# EAGLE design PCB (EAGLE 9.6.2)
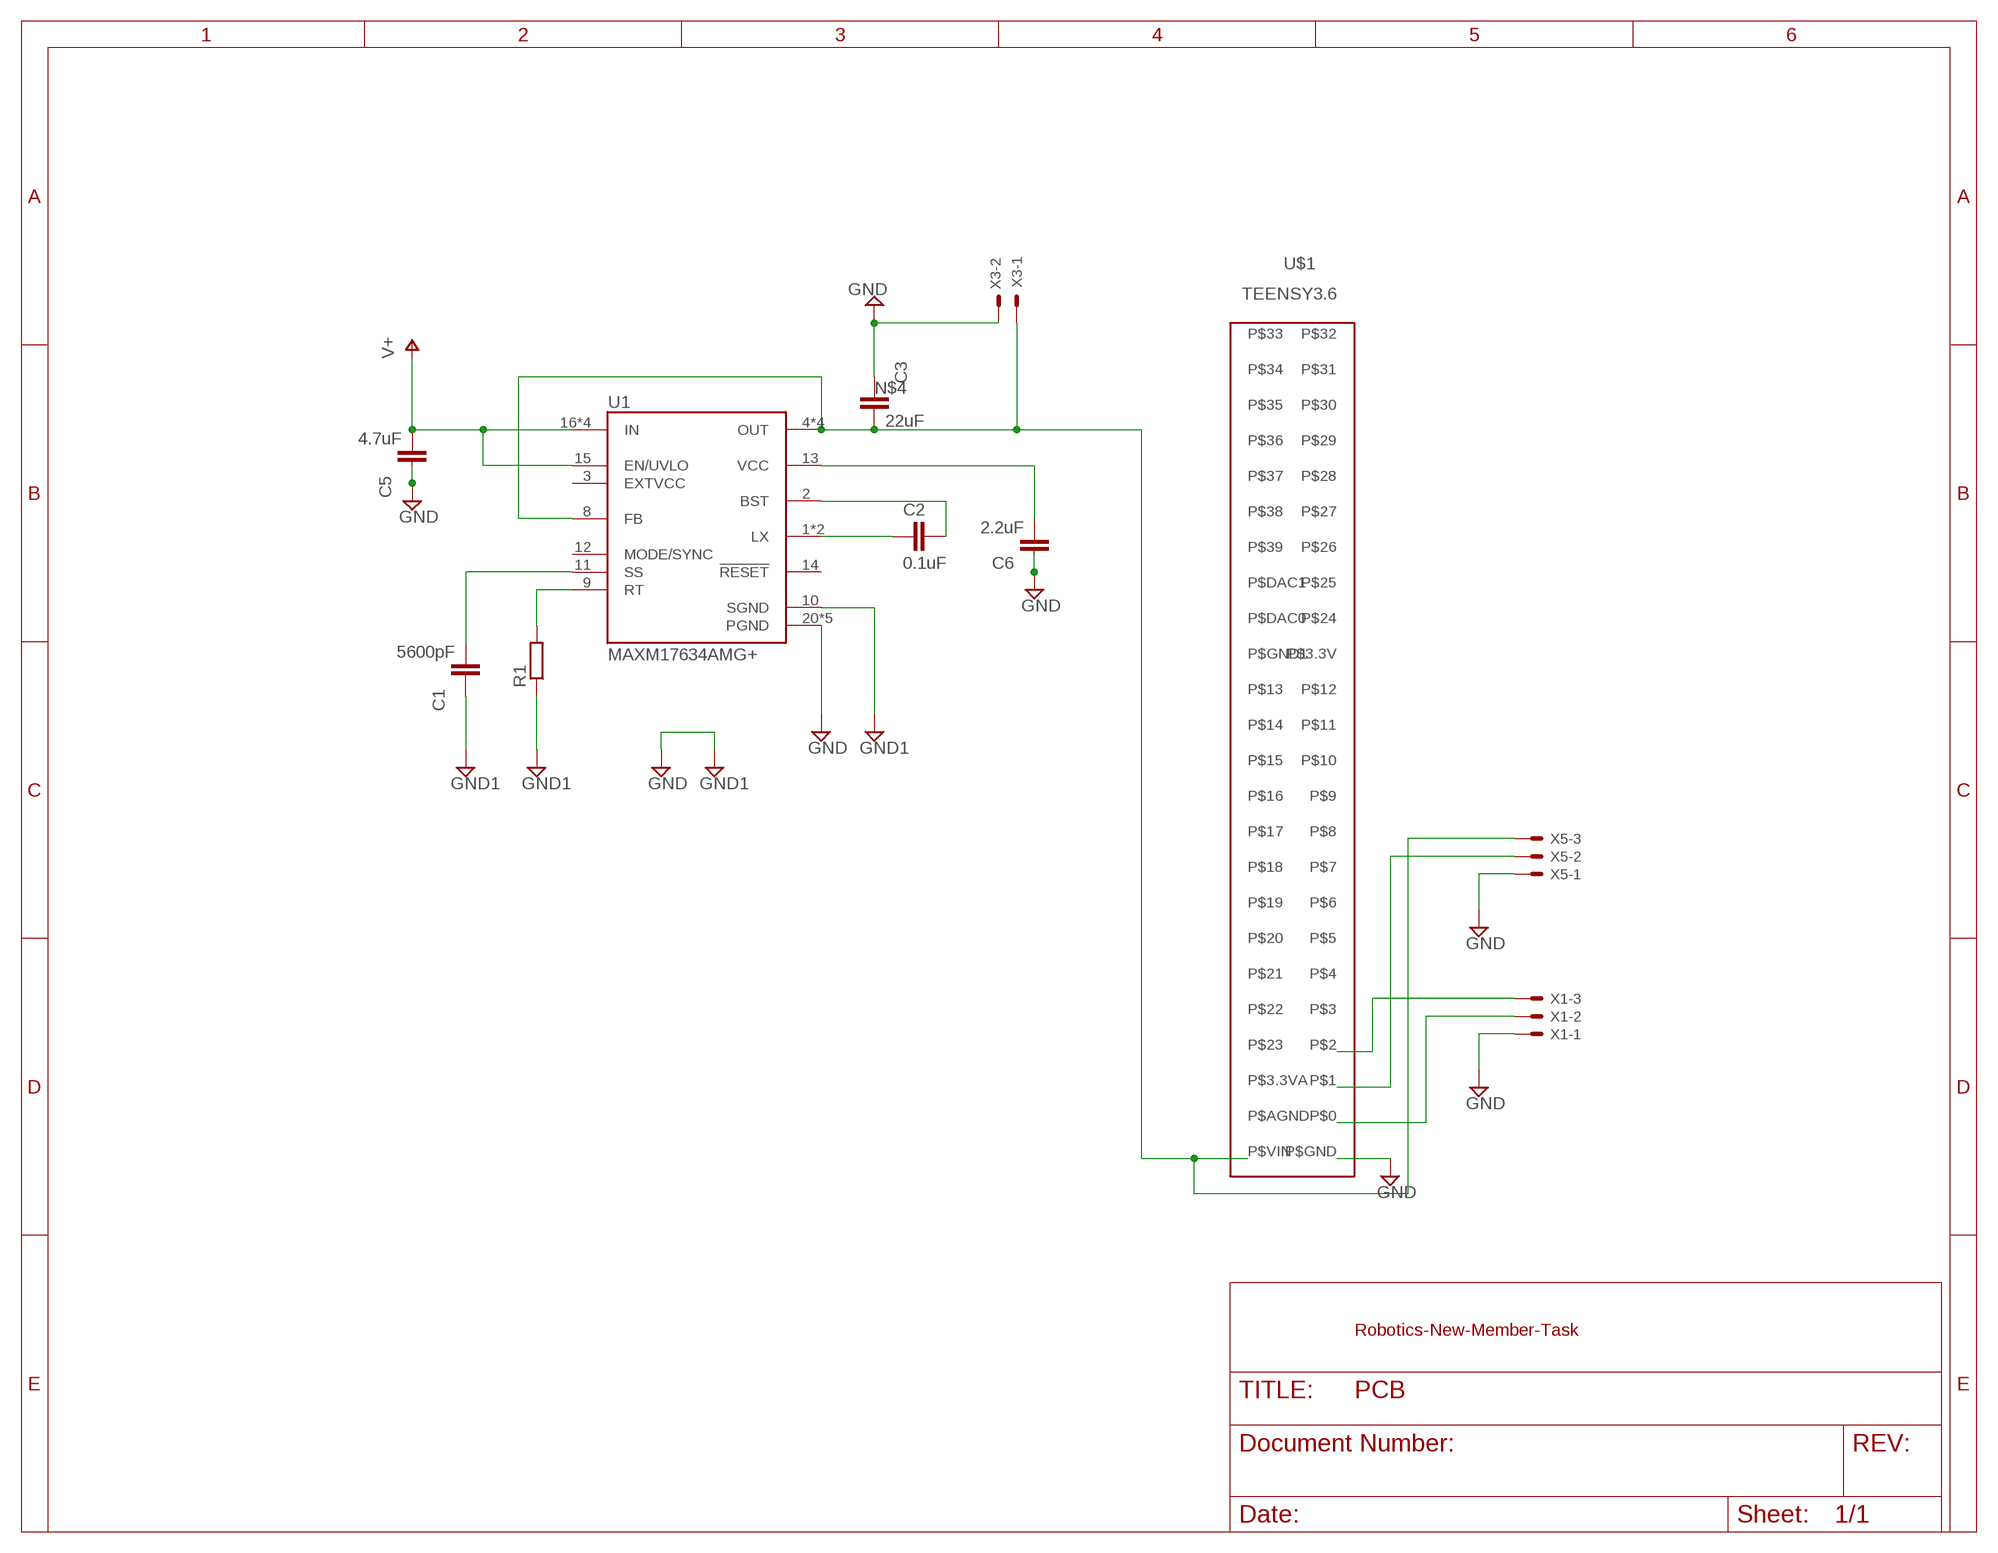
[diagram p0: schematic, sheet 1]

## Parts
C1  5600pF  C-EUC0805  [C0805]
C2  0.1uF  C-EUC0805  [C0805]
C3  22uF  C-EUC0805  [C0805]
C5  4.7uF  C-EUC0805  [C0805]
C6  2.2uF  C-EUC0805  [C0805]
R1  R-EU_R0805  [R0805]
U1  MAXM17634AMG+  [QFN50P400X400X180-25N]
U$1  TEENSY3.6  [TEENSY3.6]
X1  KK-156-3  [KK-156-3]
X3  KK-156-2  [KK-156-2]
X5  KK-156-3  [KK-156-3]

## Nets
GND: C3.1 C5.1 C6.1 U1.20(PGND) U1.21(PGND) U1.22(PGND) U1.23(PGND) U1.25(PGND) U$1.P$GND X1.1 X3.2 X5.1 ; supply symbol labelled GND1
GND1: C1.1 R1.1 U1.10(SGND)
N$1: C6.2 U1.13(VCC)
N$2: R1.2 U1.9(RT)
N$3: C1.2 U1.11(SS)
N$4: C3.2 U1.4(OUT) U1.5(OUT) U1.6(OUT) U1.7(OUT) U1.8(FB) U$1.P$VIN X3.1 X5.3
N$5: C2.1 U1.2(BST)
N$6: C2.2 U1.1(LX) U1.24(LX)
N$7: U$1.P$0 X1.2
N$8: U$1.P$1 X5.2
N$9: U$1.P$2 X1.3
V+: C5.2 U1.15(EN/UVLO) U1.16(IN) U1.17(IN) U1.18(IN) U1.19(IN)
Unconnected: U1.3(EXTVCC) U1.12(MODE/SYNC) U1.14(!RESET!) U$1.P$3 U$1.P$3.3V U$1.P$3.3VA U$1.P$4 U$1.P$5 U$1.P$6 U$1.P$7 U$1.P$8 U$1.P$9 U$1.P$10 U$1.P$11 U$1.P$12 U$1.P$13 U$1.P$14 U$1.P$15 U$1.P$16 U$1.P$17 U$1.P$18 U$1.P$19 U$1.P$20 U$1.P$21 U$1.P$22 U$1.P$23 U$1.P$24 U$1.P$25 U$1.P$26 U$1.P$27 U$1.P$28 U$1.P$29 U$1.P$30 U$1.P$31 U$1.P$32 U$1.P$33 U$1.P$34 U$1.P$35 U$1.P$36 U$1.P$37 U$1.P$38 U$1.P$39 U$1.P$AGND U$1.P$DAC0(P$DAC1) U$1.P$DAC1(P$DAC2) U$1.P$GND1

## Notes on the sheet
- Robotics-New-Member-Task

## Library data of the parts
C1-C3 C5 C6 = rcl:C-EU: CAPACITOR, European symbol; SPICEPREFIX: C
R1 = rcl:R-EU_: RESISTOR, European symbol; SPICEPREFIX: R
U1 = MAXM17634AMG_:MAXM17634AMG+: High-Efficiency Synchronous Buck Regulator Offers Balance of High Performance, Wide Temperature Range, and Small Size; DESCRIPTION: Buck Switching Regulator IC Positive Fixed 5V 1 Output 2A 24-SMD Module Exposed Pad; DIGI-KEY_PART_NUMBER: 175-MAXM17634AMG+TTR-ND; MF: Maxim Integrated; MP: MAXM17634AMG+; PACKAGE: SMD-24 Maxim Integrated; PURCHASE-URL: https://pricing.snapeda.com/search/part/MAXM17634AMG+/?ref=eda
U$1 = TEENSY:TEENSY3.6
X1 X5 = con-molex:KK-156-3: KK 156 HEADER Source: http://www.molex.com/pdm_docs/sd/026604100_sd.pdf; MF: MOLEX; OC_FARNELL: unknown; OC_NEWARK: unknown
X3 = con-molex:KK-156-2: KK 156 HEADER Source: http://www.molex.com/pdm_docs/sd/026604100_sd.pdf; MF: MOLEX; OC_FARNELL: unknown; OC_NEWARK: unknown

## Board
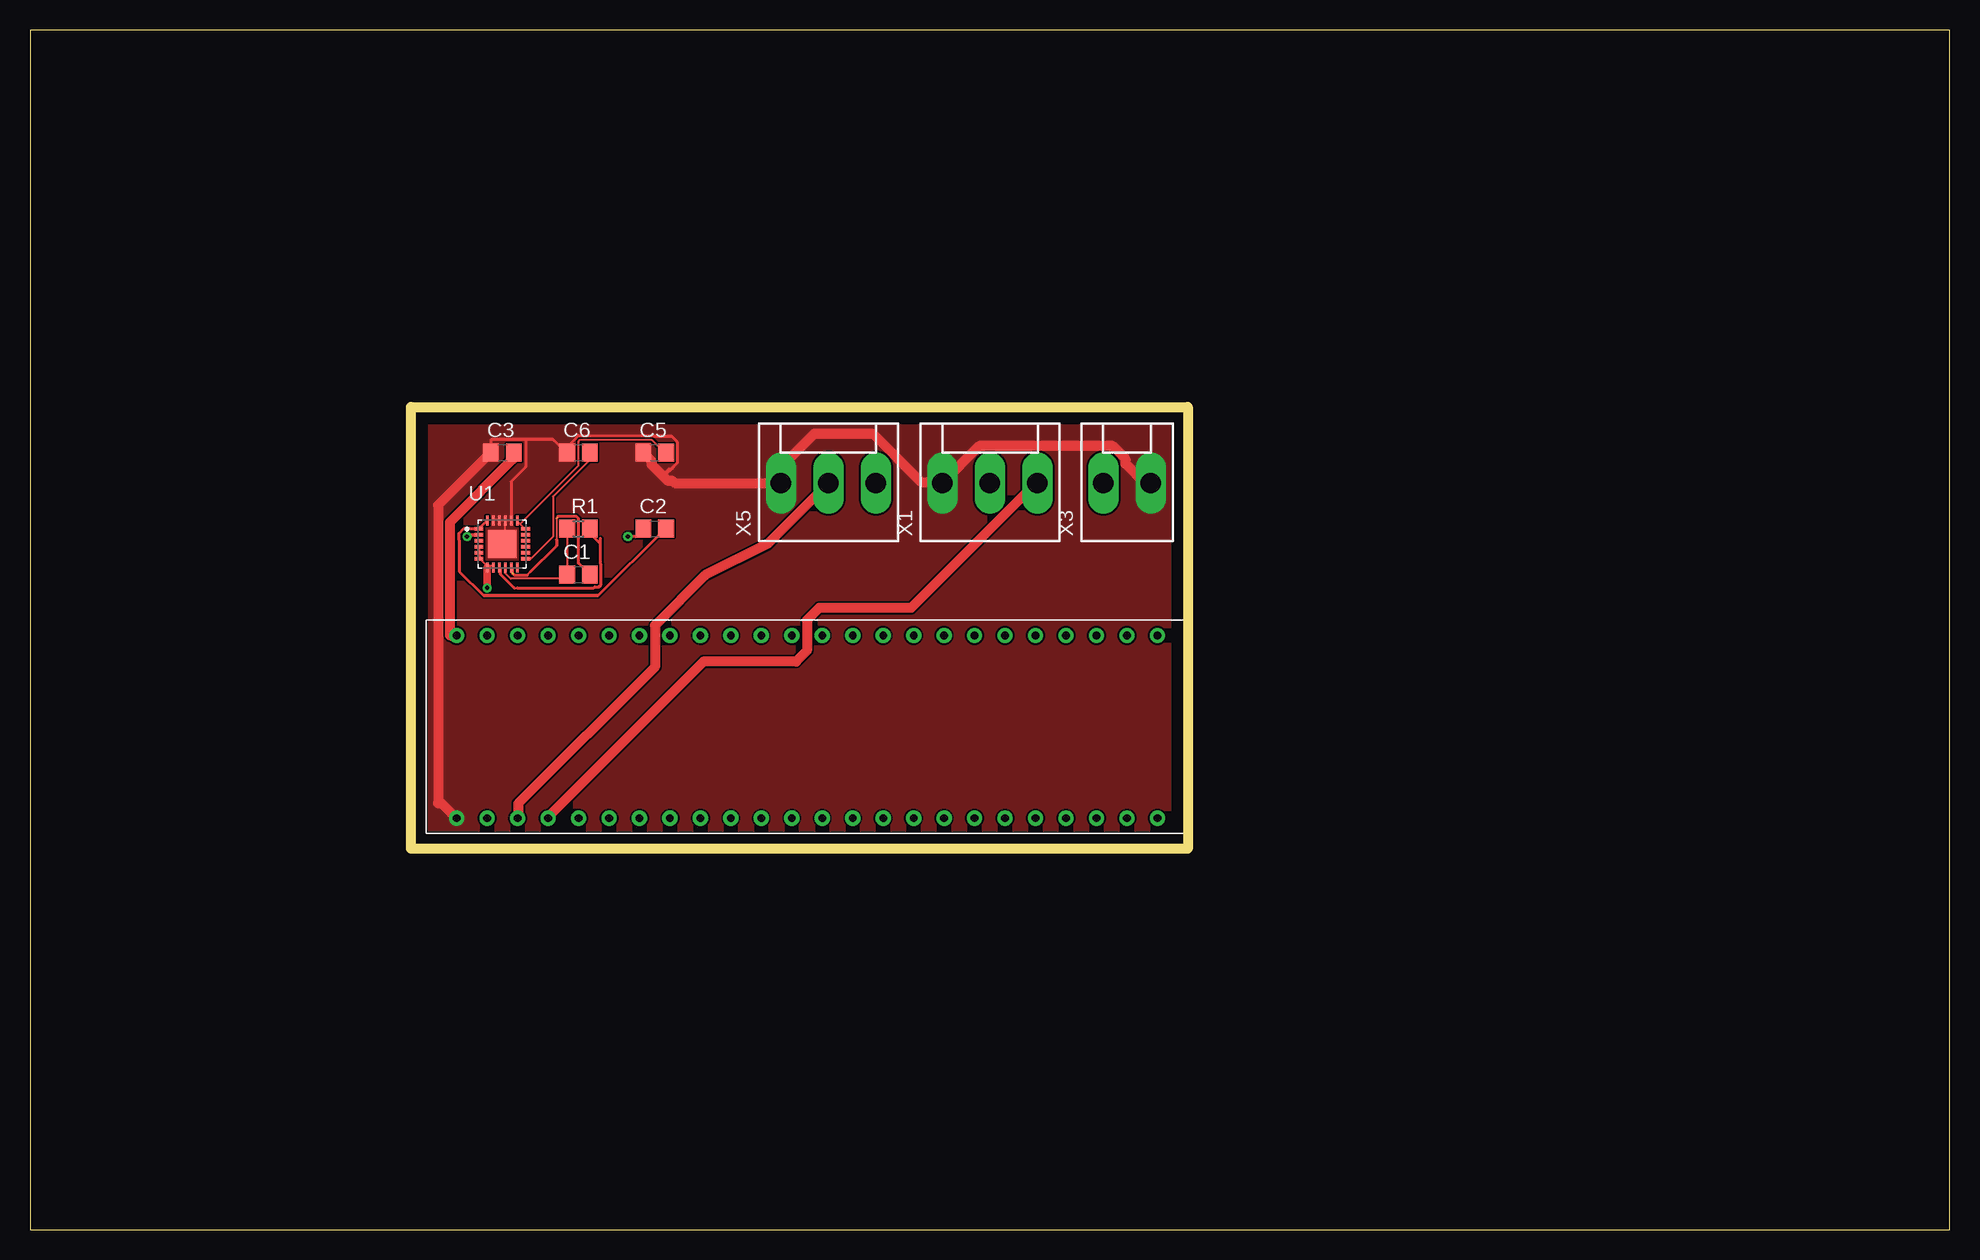
[diagram p1: board, top side]
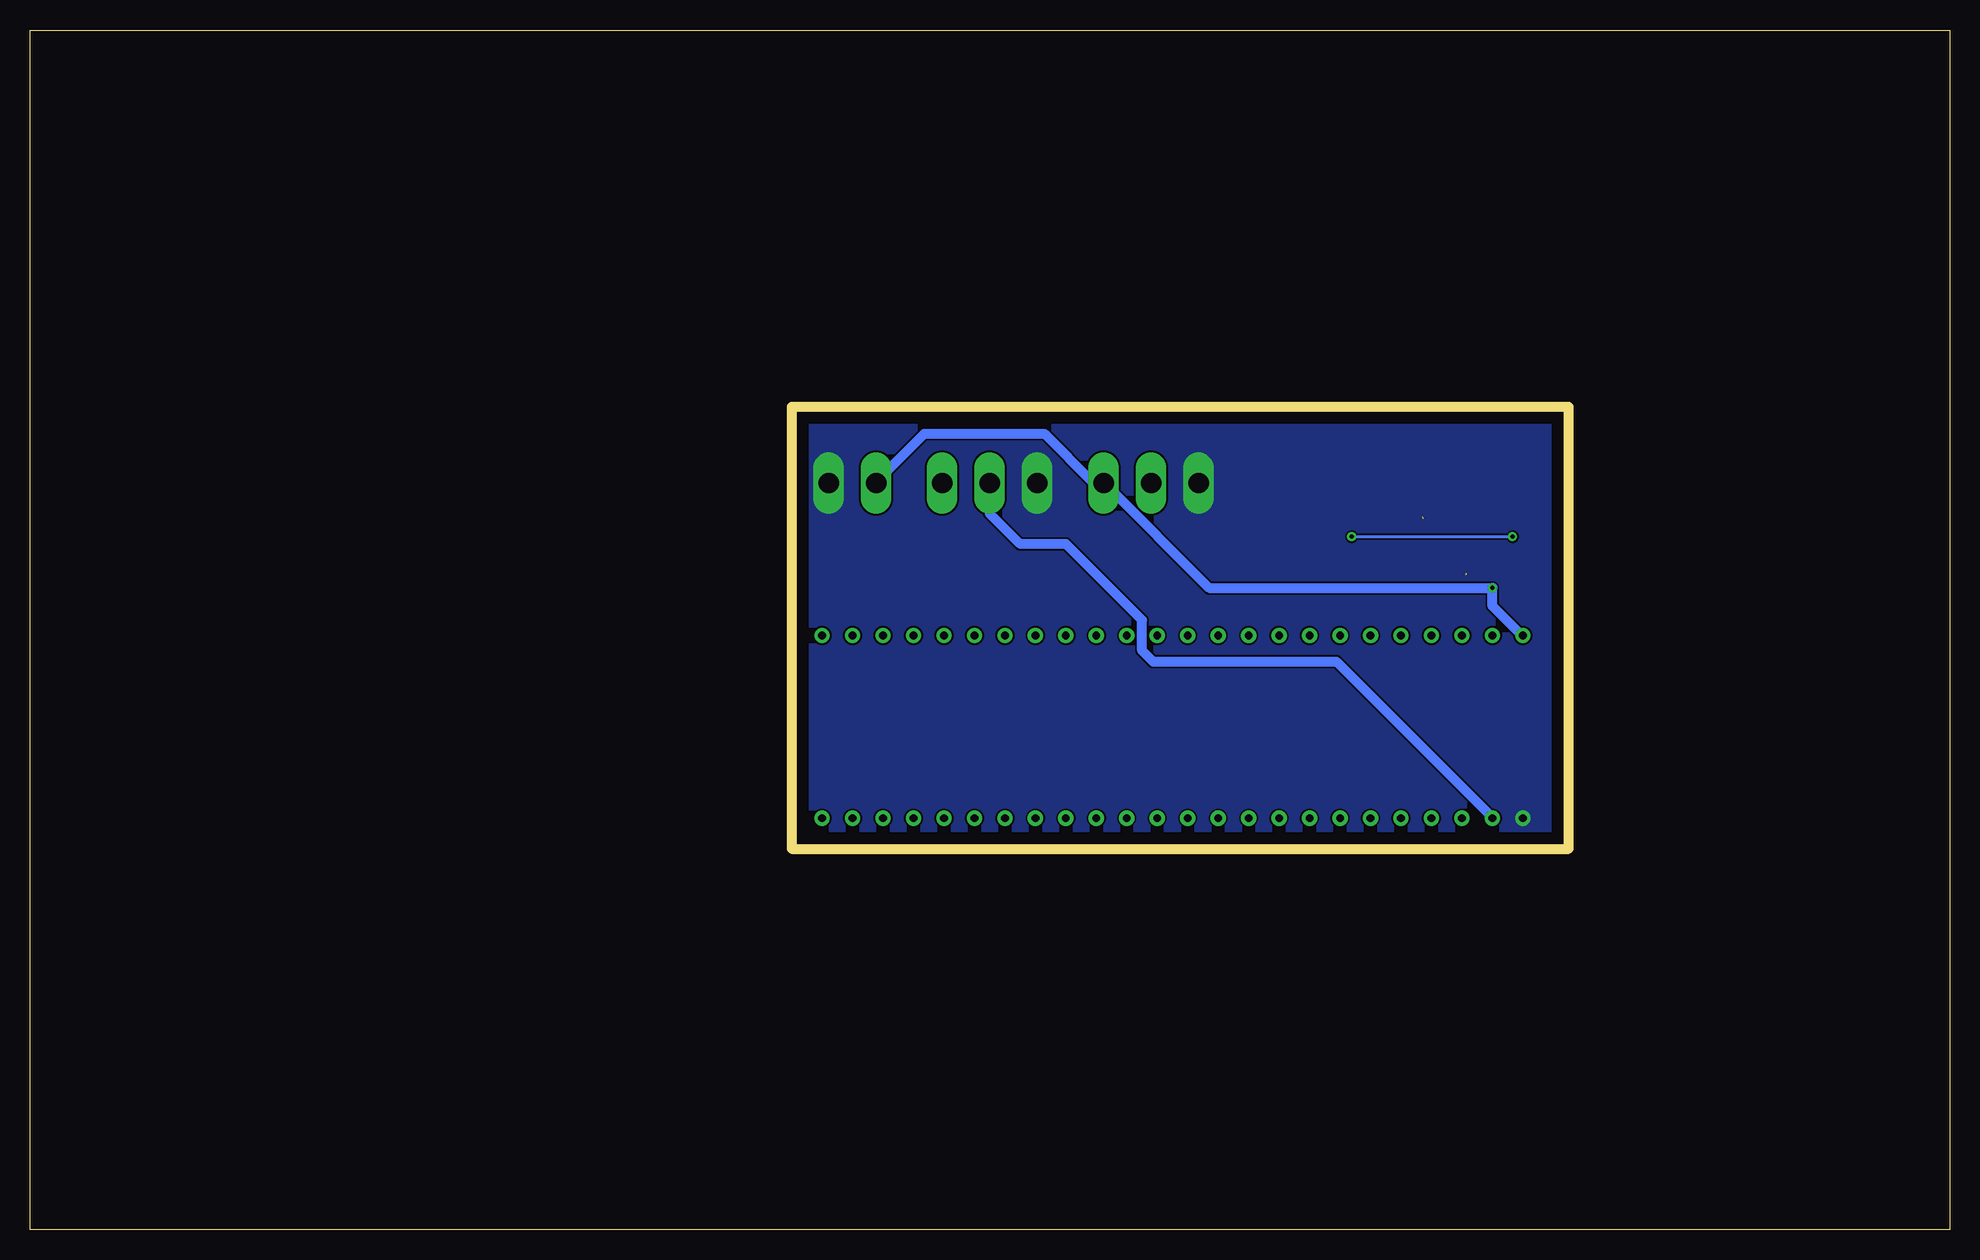
[diagram p2: board, bottom side, seen from below]

Size 160 x 100 mm. Coordinates in mm from the lower left corner, seen from the top.
Outline: 0,0 160,0 160,100 0,100 0,0
Outline: 31.75,31.75 31.75,68.58 96.52,68.58 96.52,31.75 31.75,31.75
Copper layers (1*16): Top 0.035mm / dielectric 1.5mm / Bottom 0.035mm
Design rules "default": minimum track width 6mil, minimum drill 0.35mm, track to track 6mil, track to pad 6mil, pad to pad 6mil, via to via 6mil, smd to smd 6mil, copper to edge 40mil, drill to drill 6mil, minimum pad ring 10mil, minimum via ring 8mil, stop-mask expansion 4mil, vias tented up to drill 0mil, thermal gap 10mil

### Footprints (pad centres in the part's own frame; a part is rotated, then mirrored left to right if it is on the bottom)
C0805 = smd 1.3 x 1.5: 1 -0.95,0; 2 0.95,0
R0805 = smd 1.3 x 1.5: 1 -0.95,0; 2 0.95,0
QFN50P400X400X180-25N = smd 0.81 x 0.27: 1 -1.95,1.25; 2 -1.95,0.75; 3 -1.95,0.25; 4 -1.95,-0.25; 5 -1.95,-0.75; 6 -1.95,-1.25; 13 1.95,-1.25; 14 1.95,-0.75; 15 1.95,-0.25; 16 1.95,0.25; 17 1.95,0.75; 18 1.95,1.25 | smd 0.27 x 0.81: 7 -1.25,-1.95; 8 -0.75,-1.95; 9 -0.25,-1.95; 10 0.25,-1.95; 11 0.75,-1.95; 12 1.25,-1.95; 19 1.25,1.95; 20 0.75,1.95; 21 0.25,1.95; 22 -0.25,1.95; 23 -0.75,1.95; 24 -1.25,1.95 | smd 2.35 x 2.35: 25 0,0
TEENSY3.6 = drill 0.65 pad 1.27: P$0 1.27,58.42; P$1 1.27,55.88; P$2 1.27,53.34; P$3 1.27,50.8; P$3.3V 1.27,25.4; P$3.3VA 16.51,55.88; P$4 1.27,48.26; P$5 1.27,45.72; P$6 1.27,43.18; P$7 1.27,40.64; P$8 1.27,38.1; P$9 1.27,35.56; P$10 1.27,33.02; P$11 1.27,30.48; P$12 1.27,27.94; P$13 16.51,27.94; P$14 16.51,30.48; P$15 16.51,33.02; P$16 16.51,35.56; P$17 16.51,38.1; P$18 16.51,40.64; P$19 16.51,43.18; P$20 16.51,45.72; P$21 16.51,48.26; P$22 16.51,50.8; P$23 16.51,53.34; P$24 1.27,22.86; P$25 1.27,20.32; P$26 1.27,17.78; P$27 1.27,15.24; P$28 1.27,12.7; P$29 1.27,10.16; P$30 1.27,7.62; P$31 1.27,5.08; P$32 1.27,2.54; P$33 16.51,2.54; P$34 16.51,5.08; P$35 16.51,7.62; P$36 16.51,10.16; P$37 16.51,12.7; P$38 16.51,15.24; P$39 16.51,17.78; P$AGND 16.51,58.42; P$DAC0 16.51,20.32; P$DAC1 16.51,22.86; P$GND 1.27,60.96; P$GND1 16.51,25.4; P$VIN 16.51,60.96
KK-156-3 = drill 1.7 pad 2.184 long: 1 -3.96,0; 2 0,0; 3 3.96,0
KK-156-2 = drill 1.7 pad 2.184 long: 1 -1.98,0; 2 1.98,0

### Placement (x,y rotation side)
C1  45.72,54.61 0 top
C2  52.07,58.42 0 top
C3  39.37,64.77 0 top
C5  52.07,64.77 0 top
C6  45.72,64.77 0 top
R1  45.72,58.42 0 top
U1  39.37,57.15 0 top
U$1  96.52,33.02 90 top
X1  80.01,62.23 0 top
X3  91.44,62.23 0 top
X5  66.55,62.23 0 top

### Tracks (layer width: path | path; a pad name or v marks a point on that pad's centre or on a via)
GND
  Top 0.152: U1.23 38.71,59.13 39.01,59.13 U1.22 39.17,59.13 39.62,59.13 | 39.62,59.13 40.08,59.13 U1.20 | 39.62,59.13 U1.21 39.62,58.98 39.62,57.3 39.47,57.15 U1.25 | 44.5,64.92 44.65,64.77 C6.1 44.5,64.92 | 38.41,64.77 C3.1 | 52.91,63.07 53.03,62.94 53.47,63.37 53.95,63.86 53.95,65.68 | 51.64,64.34 51.21,64.77 C5.1 | 62.64,62.33 X5.1 | X3.2 93.27,62.33 92.81,62.33 90.07,65.08 78.94,65.08 76.2,62.33 X1.1 | 44.5,64.92 45.72,66.14 53.34,66.14
  Top 0.254: C3.1 38.42,65.84 41.3,65.84 | 41.3,65.84 43.59,65.84 44.5,64.92 | U1.20 40.12,62.37 41.3,63.55 41.3,65.84 | C6.1 44.77,65.24 45.73,66.19 51.96,66.19 52.01,66.14 53.34,66.14 53.49,66.14 53.95,65.68 53.95,63.9 53.47,63.42 53.47,63.37 53.21,63.37 52.91,63.07 51.64,64.34 | 53.03,62.94 53.54,62.43 53.65,62.33 62.64,62.33 | 71.17,65.08 73.91,62.33 74.93,62.33 76.05,62.33 76.2,62.33
  Top 0.813: 38.41,64.77 34.01,60.38 34.01,35.56 34.29,35.56 U$1.P$GND | C5.1 51.81,64.08 51.81,63.79 53.17,62.43 53.54,62.43 | 53.65,62.33 53.75,62.23 X5.1 62.59,63.55 65.38,66.34 66.65,66.34 66.79,66.34 70.26,66.34 74.28,62.33 74.93,62.33 75.95,62.33 X1.1 | X1.1 76.05,62.33 | X1.1 79.16,65.34 90.22,65.34 91.29,64.27 91.29,63.85 92.81,62.33
  pour Top (no thermals): 31.75,31.75 31.75,68.58 96.52,68.58 96.52,31.75
  pour Bottom (no thermals): 31.75,31.75 31.75,68.58 96.52,68.58 96.52,31.75
GND1
  Top 0.152: U1.10 39.62,55.17 39.62,54.71 40.08,54.25 44.35,54.25 44.65,54.56 C1.1 44.81,54.71 44.81,58.37 R1.1
N$1
  Top 0.152: U1.13 41.45,55.93 41.76,55.93 43.59,57.76 43.59,61.11 46.63,64.16 46.63,64.77 C6.2
N$2
  Top 0.152: 39.32,54.56 40.39,53.49 40.64,53.49 | 46.99,53.49 47.4,53.49 47.55,53.65 47.55,57.15 | 46.86,58.29 46.79,58.37 R1.2
  Top 0.254: U1.9 39.21,55.11 39.21,54.63 40.34,53.49 40.39,53.49 | 40.64,53.49 46.99,53.49 47.08,53.58 47.44,53.58 47.5,53.65 | 47.5,53.65 47.55,53.65 | 47.5,53.65 47.6,53.74 47.6,55.48 47.55,55.53 47.55,57.15 | 47.55,57.15 47.55,57.61 | 47.55,57.15 46.86,57.84 46.86,58.29
N$3  (2 unrouted)
  Top 0.152: 40.39,54.56 40.23,54.71 | 41.45,54.56 41.71,54.81 | 43.89,59.28 44.04,59.44 | 44,59.45 44,59.38 43.89,59.26 43.89,57.5
  Top 0.254: C1.2 45.72,55.56 45.72,59.28 45.55,59.45 44,59.45 43.94,59.39 | U1.11 40.21,55.11 40.21,54.7 40.3,54.61 | 40.39,54.56 41.45,54.56 | 41.71,54.81 43.89,57 43.89,57.5
N$4  (via drill 0.35)
  Top 0.152: U1.7 38.25,55.32 38.56,55.32 U1.8 | 37.49,56.39 37.49,55.93 | 37.49,56.39 37.49,56.84 U1.4 | 37.49,56.39 U1.5 | 37.49,55.93 38.1,55.32 U1.7 | 37.49,55.93 U1.6 | 40.23,64.21 40.23,64.77 C3.2 | 38.1,55.17 U1.7
  Top 0.61: v38.1,53.49 38.1,55.17
  Top 0.813: 40.23,64.21 35,58.98 35,49.53 U$1.P$VIN
  Bottom 0.152: 35.66,49.53 U$1.P$VIN | 70.56,62.33 X5.3 70.41,62.18 | 89.46,62.33 X3.1
  Bottom 0.813: 35.66,49.53 38.1,51.97 v38.1,53.49 61.72,53.49 70.41,62.18 | 70.56,62.33 71.42,62.33 75.44,66.34 85.45,66.34 89.46,62.33
N$5  (via drill 0.35)
  Top 0.152: 37.34,57.91 U1.2 | 51.05,58.37 C2.1
  Top 0.254: v36.42,57.76 36.58,57.91 | v49.84,57.76 50.44,57.76 51.05,58.37
  Top 0.305: 36.58,57.91 37.34,57.91
  Bottom 0.254: v49.84,57.76 v36.42,57.76
N$6
  Top 0.152: 37.49,58.52 U1.1 | 37.72,52.96 37.8,52.88 47.4,52.88 52.88,58.37 C2.2
  Top 0.254: U1.24 37.54,58.52 37.49,58.52 | U1.1 36.71,58.4 36.7,58.42 36.15,58.42 35.77,58.03 35.77,57.49 35.79,57.47 35.79,54.87 37.83,52.84 47.35,52.84 52.88,58.37
N$7
  Bottom 0.152: U$1.P$0 38.1,34.34 | 80.01,62.18 X1.2 | 80.01,59.69 80.01,60.96
  Bottom 0.813: 38.1,34.34 51.1,47.35 66.4,47.35 67.31,48.26 67.31,50.8 73.66,57.15 77.47,57.15 80.01,59.69 X1.2
N$8
  Top 0.152: 40.69,34.29 U$1.P$1
  Top 0.813: 40.69,34.29 40.69,35.51 52.09,46.91 52.09,50.37 56.29,54.56 61.47,57.15 X5.2
N$9
  Top 0.152: 83.82,62.18 X1.3
  Top 0.813: U$1.P$2 43.18,34.39 56.13,47.35 63.86,47.35 64.77,48.26 64.77,50.8 65.79,51.82 73.46,51.82 83.82,62.18
V+
  Top 0.152: U1.15 41.3,57 41.3,57.3 U1.16 41.3,57.45 41.3,57.91 | 41.3,58.37 40.84,58.83 | 40.84,58.83 40.69,58.98 U1.19 | 41.3,58.37 41.3,57.91 | 41.3,58.37 U1.18 | 41.3,57.91 U1.17 | 40.84,58.83 45.72,63.7 45.72,65.68 45.87,65.84 51.82,65.84 52.88,64.77 C5.2